# Altium project 5vTo3v3LDO.PrjPcb
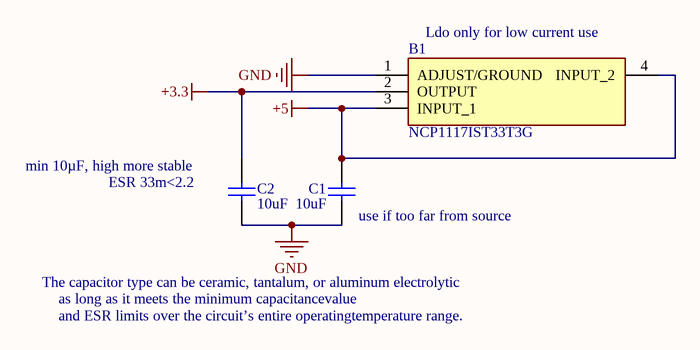
[diagram p0: test1.SchDoc]
1 sheet, 3 parts. Net scope: global (net labels, ports and power ports of the same name join across sheets).
Board file: LDO.PcbDoc

## Sheet test1.SchDoc
size A4; SheetNumber: 1; SheetTotal: 1

### Parts
B1  NCP1117IST33T3G  [SOT230P700X180-4N]
C1  10uF  [0603_SMD_RC]
C2  10uF  [0603_SMD_RC]

### Nets
+3.3: B1.2(OUTPUT) C2.2
+5: B1.3(INPUT_1) B1.4(INPUT_2) C1.2
GND: B1.1(ADJUST/GROUND) C1.1 C2.1

### Notes on the sheet
- (near B1) Ldo only for low current use
- (near C2) min 10µF, high more stable
- (near C2) ESR 33m<2.2
- (near C1) use if too far from source
- The capacitor type can be ceramic, tantalum, or aluminum electrolytic
- as long as it meets the minimum capacitancevalue
- and ESR limits over the circuit’s entire operatingtemperature range.

### Library data of the parts
B1 = CMP-052-000000-1: Linear Voltage Regulator IC Positive Fixed 1 Output 1A SOT-223; Manufacturer_Name: onsemi; Geometry.Height: 1.8mm; Source: NCP1117IST33T3G.SchLib; Manufacturer_Part_Number: NCP1117IST33T3G; Mouser Part Number: 863-NCP1117IST33T3G; Datasheet Link: https://www.onsemi.com/pdf/datasheet/ncp1117-d.pdf; Mouser Price/Stock: https://www.mouser.co.uk/ProductDetail/onsemi/NCP1117IST33T3G?qs=iLbezkQI%252BsgWHC6Yi9bFVA%3D%3D; Design Item ID: NCP1117IST33T3G
C1 C2 = SMD 0603 Capacitor: Value: 10uF